# EAGLE design AUX power board (V3.2) (EAGLE 7.5.0)
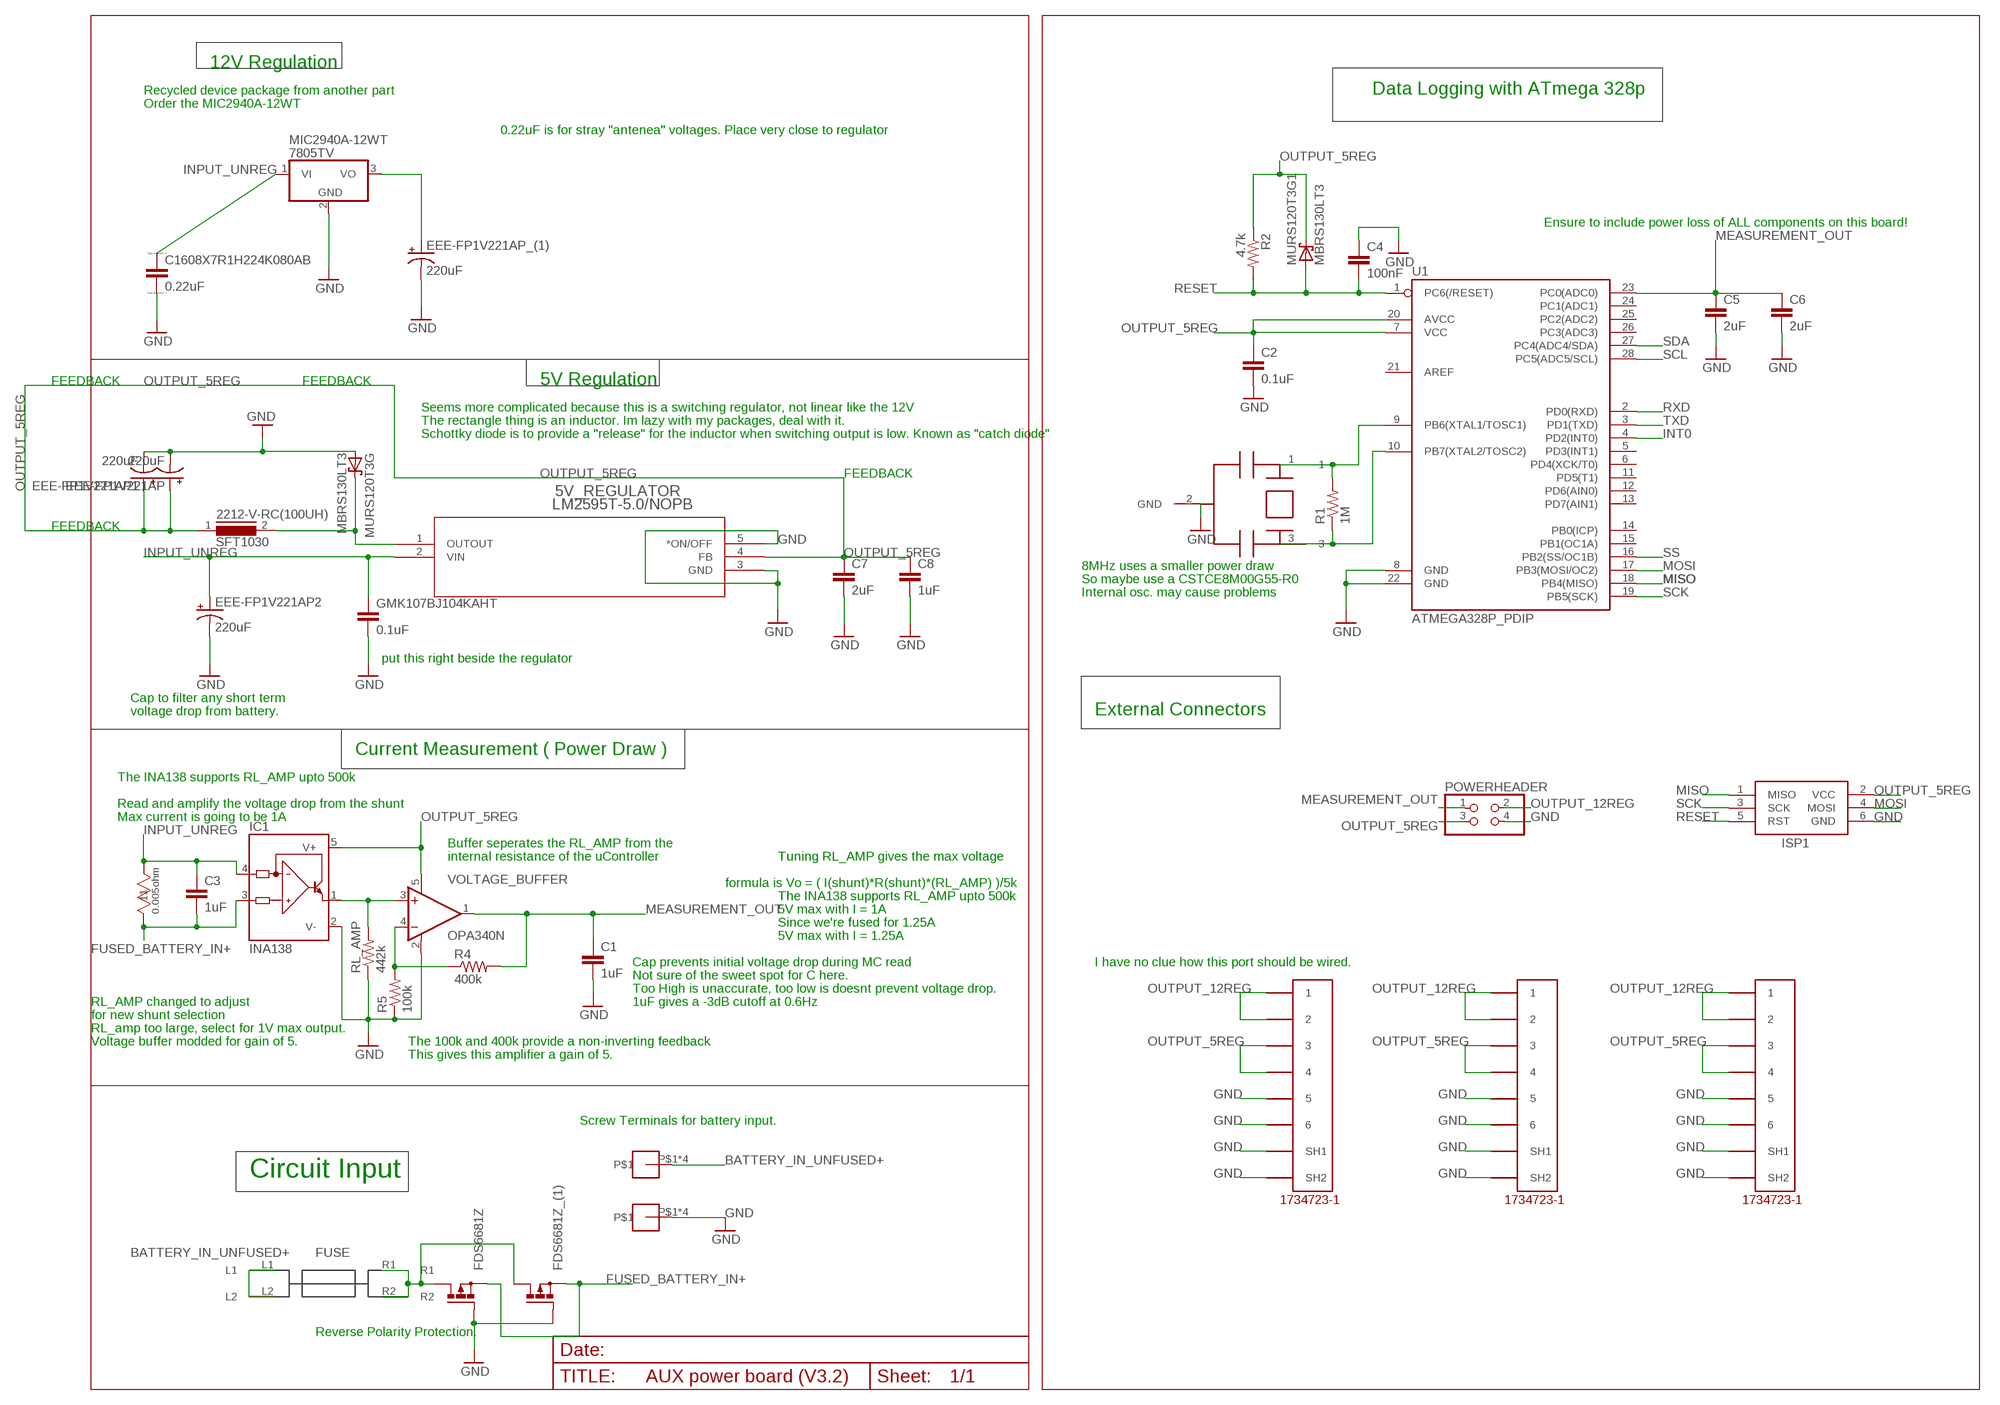
[diagram p0: schematic, sheet 1]

## Parts
5V_REGULATOR  LM2595T-5.0/NOPB  [T05D]
15FR005E  15FR005E  [RES_15]
2212-V-RC(100UH)  SFT1030  [SFT1030]
C1  1uF  C-EUC0603  [C0603]
C2  0.1uF  C-EUC0603  [C0603]
C3  1uF  C-EUC0603  [C0603]
C4  100nF  C-EUC0603  [C0603]
C5  2uF  C-EUC0603  [C0603]
C6  2uF  C-EUC0603  [C0603]
C7  2uF  C-EUC0603  [C0603]
C8  1uF  C-EUC0603  [C0603]
C1608X7R1H224K080AB  0.22uF  CC0603  [C0603]
CSTCE8M00G55-R0  CSTCE16M0V53-R0  [RESONATOR]
EEE-FP1V221AP  220uF  CPOL-US175TMP-0808  [175TMP-0808]
EEE-FP1V221AP1  220uF  CPOL-US175TMP-0808  [175TMP-0808]
EEE-FP1V221AP2  220uF  CPOL-US175TMP-0808  [175TMP-0808]
EEE-FP1V221AP_(1)  220uF  CPOL-US175TMP-0808  [175TMP-0808]
FDS6681Z  P-MOSFET-SO8  [SO-08]
FDS6681Z_(1)  P-MOSFET-SO8  [SO-08]
GMK107BJ104KAHT  0.1uF  C-EUC0603  [C0603]
IC1  INA138  [SOT23-5]
ISP1  AVRISP-6  [AVRISP]
MIC2940A-12WT  7805TV  [TO220V]
MINIBLADE  3568  [3568]
MURS120T3G  MBRS130LT3  [SMB]
MURS120T3G1  MBRS130LT3  [SMB]
POWERHEADER  PINHD-2X2  [2X02]
R1  1M  R-US_R0603  [R0603]
R2  4.7k  R-US_R0603  [R0603]
R4  400k  R-US_R0603  [R0603]
R5  100k  R-US_R0603  [R0603]
RL_AMP  442k  R-US_R0603  [R0603]
U1  ATMEGA328P_PDIP  [DIL28-3]
U$3  5555140-6  [1734723-1_RJ11]
U$4  5555140-6  [1734723-1_RJ11]
U$5  5555140-6  [1734723-1_RJ11]
U$6  SCREW-8191  [SCREW-8191]
U$7  SCREW-8191  [SCREW-8191]
VOLTAGE_BUFFER  OPA340N  [SOT23-5]

## Nets
BATTERY_IN_UNFUSED+: MINIBLADE.L1 MINIBLADE.L2 U$6.P$1 U$6.P$2 U$6.P$3 U$6.P$4
FUSED_BATTERY_IN+: 15FR005E.1 C3.2 FDS6681Z.1(S) FDS6681Z.2(S) FDS6681Z.3(S) FDS6681Z_(1).1(S) FDS6681Z_(1).2(S) FDS6681Z_(1).3(S) IC1.3(IN+)
GND: 5V_REGULATOR.3(GND) 5V_REGULATOR.5(*ON/OFF) C1.2 C2.2 C4.1 C5.2 C6.2 C7.2 C8.2 C1608X7R1H224K080AB.2 CSTCE8M00G55-R0.2(GND) EEE-FP1V221AP1.- EEE-FP1V221AP2.- EEE-FP1V221AP.- EEE-FP1V221AP_(1).- FDS6681Z.4(G) FDS6681Z_(1).4(G) GMK107BJ104KAHT.2 IC1.2(V-) ISP1.6(GND) MIC2940A-12WT.2(GND) MURS120T3G.A POWERHEADER.4 R5.1 RL_AMP.1 U1.8(GND) U1.22(GND) U$3.5 U$3.6 U$3.SH1 U$3.SH2 U$4.5 U$4.6 U$4.SH1 U$4.SH2 U$5.5 U$5.6 U$5.SH1 U$5.SH2 U$7.P$1 U$7.P$2 U$7.P$3 U$7.P$4 VOLTAGE_BUFFER.2(V-)
INPUT_UNREG: 5V_REGULATOR.2(VIN) 15FR005E.2 C3.1 C1608X7R1H224K080AB.1 EEE-FP1V221AP2.+ GMK107BJ104KAHT.1 IC1.4(IN-) MIC2940A-12WT.1(VI)
INT0: U1.4(PD2(INT0))
MEASUREMENT_OUT: C1.1 C5.1 C6.1 POWERHEADER.1 R4.2 U1.23(PC0(ADC0)) VOLTAGE_BUFFER.1(OUT)
MISO: ISP1.1(MISO) U1.18(PB4(MISO))
MMM: FDS6681Z.5(D) FDS6681Z.6(D) FDS6681Z.7(D) FDS6681Z.8(D) FDS6681Z_(1).5(D) FDS6681Z_(1).6(D) FDS6681Z_(1).7(D) FDS6681Z_(1).8(D) MINIBLADE.R1 MINIBLADE.R2
MOSI: ISP1.4(MOSI) U1.17(PB3(MOSI/OC2))
N$1: 5V_REGULATOR.1(OUTOUT) 2212-V-RC(100UH).2 MURS120T3G.C
N$2: R4.1 R5.2 VOLTAGE_BUFFER.4(-IN)
N$3: IC1.1(OUT) RL_AMP.2 VOLTAGE_BUFFER.3(+IN)
N$18: CSTCE8M00G55-R0.1 R1.2 U1.9(PB6(XTAL1/TOSC1))
N$19: CSTCE8M00G55-R0.3 R1.1 U1.10(PB7(XTAL2/TOSC2))
OUTPUT_5REG: 5V_REGULATOR.4(FB) 2212-V-RC(100UH).1 C2.1 C7.1 C8.1 EEE-FP1V221AP1.+ EEE-FP1V221AP.+ IC1.5(V+) ISP1.2(VCC) MURS120T3G1.C POWERHEADER.3 R2.1 U1.7(VCC) U1.20(AVCC) U$3.3 U$3.4 U$4.3 U$4.4 U$5.3 U$5.4 VOLTAGE_BUFFER.5(V+)
OUTPUT_12REG: EEE-FP1V221AP_(1).+ MIC2940A-12WT.3(VO) POWERHEADER.2 U$3.1 U$3.2 U$4.1 U$4.2 U$5.1 U$5.2
RESET: C4.2 ISP1.5(RST) MURS120T3G1.A R2.2 U1.1(PC6(/RESET))
RXD: U1.2(PD0(RXD))
SCK: ISP1.3(SCK) U1.19(PB5(SCK))
SCL: U1.28(PC5(ADC5/SCL))
SDA: U1.27(PC4(ADC4/SDA))
SS: U1.16(PB2(SS/OC1B))
TXD: U1.3(PD1(TXD))
Unconnected: U1.5(PD3(INT1)) U1.6(PD4(XCK/T0)) U1.11(PD5(T1)) U1.12(PD6(AIN0)) U1.13(PD7(AIN1)) U1.14(PB0(ICP)) U1.15(PB1(OC1A)) U1.21(AREF) U1.24(PC1(ADC1)) U1.25(PC2(ADC2)) U1.26(PC3(ADC3))

## Notes on the sheet
- 12V Regulation
- Recycled device package from another part | Data Logging with ATmega 328p
- Order the MIC2940A-12WT
- 0.22uF is for stray "antenea" voltages. Place very close to regulator
- Ensure to include power loss of ALL components on this board!
- FEEDBACK | FEEDBACK | 5V Regulation
- Seems more complicated because this is a switching regulator, not linear like the 12V
- The rectangle thing is an inductor. Im lazy with my packages, deal with it.
- Schottky diode is to provide a "release" for the inductor when switching output is low. Known as "catch diode"
- FEEDBACK
- FEEDBACK
- 8MHz uses a smaller power draw
- So maybe use a CSTCE8M00G55-R0
- Internal osc. may cause problems
- put this right beside the regulator
- Cap to filter any short term
- voltage drop from battery. | External Connectors
- Current Measurement ( Power Draw )
- The INA138 supports RL_AMP upto 500k
- Read and amplify the voltage drop from the shunt
- Max current is going to be 1A
- Buffer seperates the RL_AMP from the
- internal resistance of the uController | Tuning RL_AMP gives the max voltage
- formula is Vo = ( I(shunt)*R(shunt)*(RL_AMP) )/5k
- The INA138 supports RL_AMP upto 500k
- 5V max with I = 1A
- Since we're fused for 1.25A
- 5V max with I = 1.25A
- Cap prevents initial voltage drop during MC read | I have no clue how this port should be wired.
- Not sure of the sweet spot for C here.
- Too High is unaccurate, too low is doesnt prevent voltage drop.
- RL_AMP changed to adjust | 1uF gives a -3dB cutoff at 0.6Hz
- for new shunt selection
- RL_amp too large, select for 1V max output.
- Voltage buffer modded for gain of 5. | The 100k and 400k provide a non-inverting feedback
- This gives this amplifier a gain of 5.
- Screw Terminals for battery input.
- Circuit Input
- Reverse Polarity Protection.

## Library data of the parts
5V_REGULATOR = LM2595T-5:LM2595T-5.0/NOPB; COPYRIGHT: Copyright C 2015 Accelerated Designs. All rights reserved; MANUFACTURER_PART_NUMBER: LM2595T50; VENDOR: National Semiconductor
15FR005E = 15FR005E:15FR005E; COPYRIGHT: Copyright C 2015 Accelerated Designs. All rights reserved; MANUFACTURER_PART_NUMBER: 15FR005E; VENDOR: Ohmite
2212-V-RC(100UH) = inductors:SFT1030: INDUCTOR
C1 C2 = resistor:C-EU: CAPACITOR, European symbol
C3-C8 GMK107BJ104KAHT = rcl:C-EU: CAPACITOR, European symbol
C1608X7R1H224K080AB = eagle-ltspice:C: CAPACITOR, European symbol; SPICEMODEL: NONE; SPICEPREFIX: C
CSTCE8M00G55-R0 = arduino_Uno_Rev3-02-TH:CSTCE16M0V53-R0
EEE-FP1V221AP EEE-FP1V221AP1 EEE-FP1V221AP2 EEE-FP1V221AP_(1) = rcl:CPOL-US: POLARIZED CAPACITOR, American symbol
FDS6681Z FDS6681Z_(1) = transistor-power:P-MOSFET-SO8: P-Channel MOSFET Example: FDS4435A; P-Channel Logic Level PowerTrench® MOSFET FDS4465; P-Channel 1.8V Specified PowerTrench® MOSFET Source: www.fairchildsemi.com
IC1 = burr-brown:INA138: High-Side Measurement Current Shunt Monitor; MF: TEXAS INSTRUMENTS; MPN: INA138NA/250; OC_FARNELL: 1564888; OC_NEWARK: 80K5906
ISP1 = adafruit:AVRISP: AVR ISP HEADER Standard 6 pin header for AVR programming
MIC2940A-12WT = linear:78*: Positive VOLTAGE REGULATOR Source: http://cache.national.com/ds/LM/LM78L05.pdf http://www.fairchildsemi.com/ds/LM/LM7805.pdf
MINIBLADE = fuse:3568
MURS120T3G MURS120T3G1 = diode:MBRS130LT3: Schottky Power Rectifier Source: http://www.onsemi.com/pub/Collateral/MBRS130LT3-D.PDF
POWERHEADER = pinhead:PINHD-2X2: PIN HEADER
R1 = rcl:R-US_: RESISTOR, American symbol
R2 R4 R5 RL_AMP = resistor:R-US_: RESISTOR, American symbol
U1 = SparkFun-DigitalIC:ATMEGA328P_PDIP: uC used in the Arduino 32kb flash, 1k EEPROM, 2k SRAM This is the through-hole version of this chip.
U$3-U$5 = 5555140-6 RJ11:5555140-6
U$6 U$7 = Shell2013:SCREW-8191
VOLTAGE_BUFFER = burr-brown:OPA340: Rail-to-Rail Operational Amplifiers Single-Supply, MicroAmplifier(TM) Series; MPN: OPA340NA/3KG4; OC_FARNELL: 1234805; OC_NEWARK: 13M5177

## Board
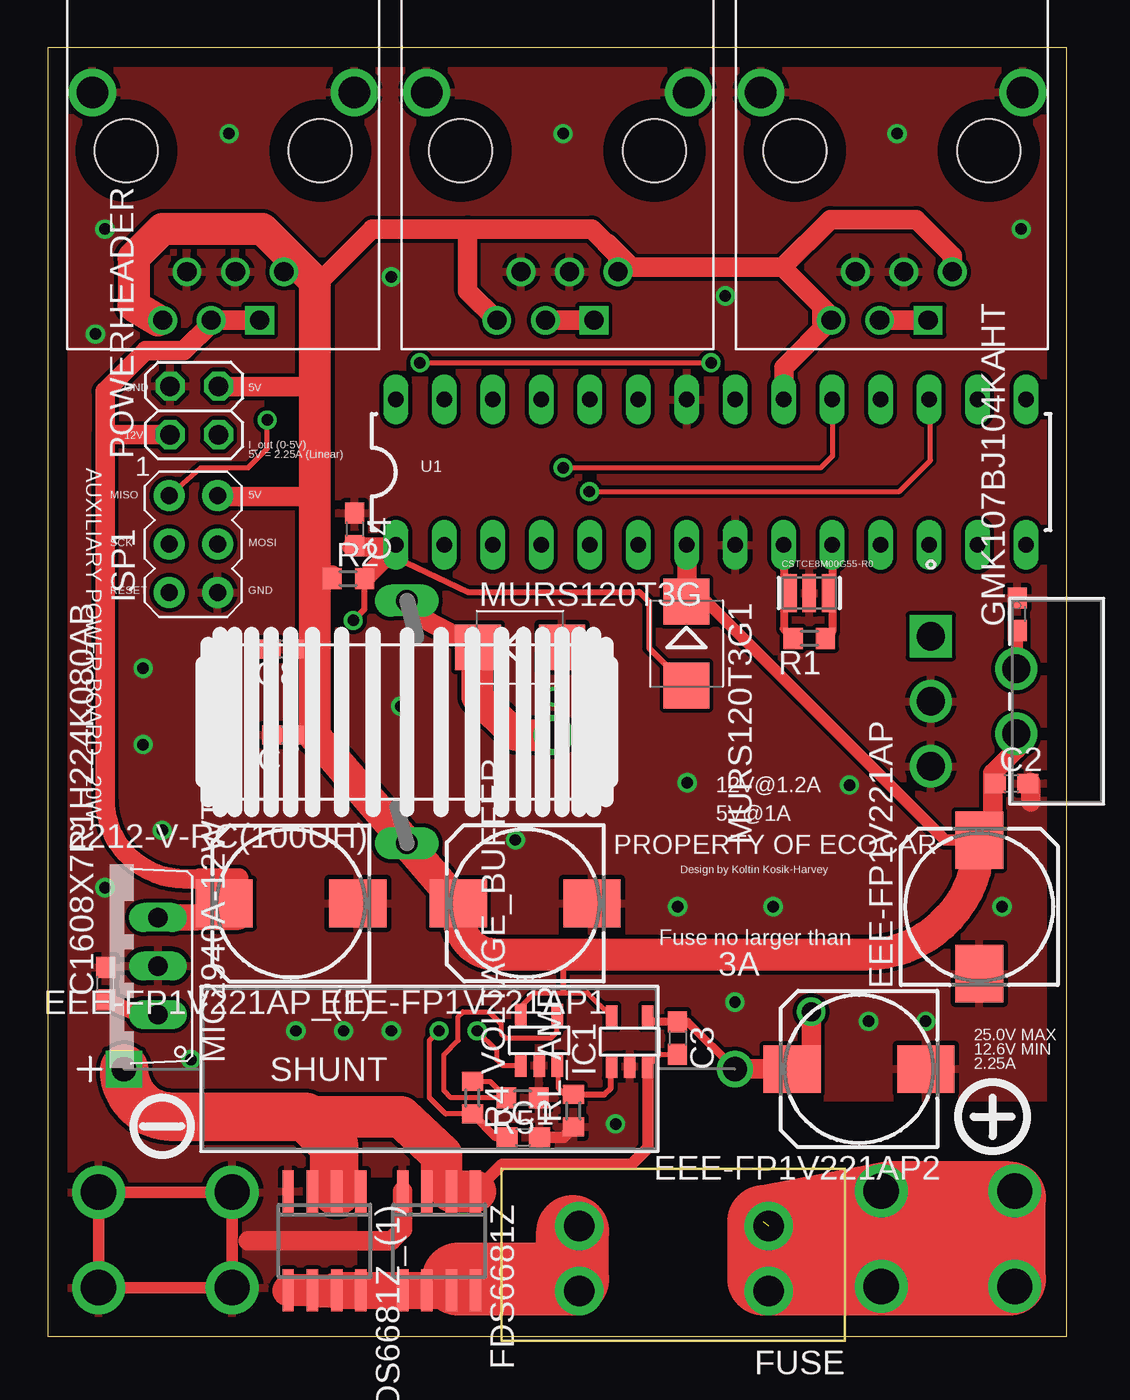
[diagram p1: board, top side]
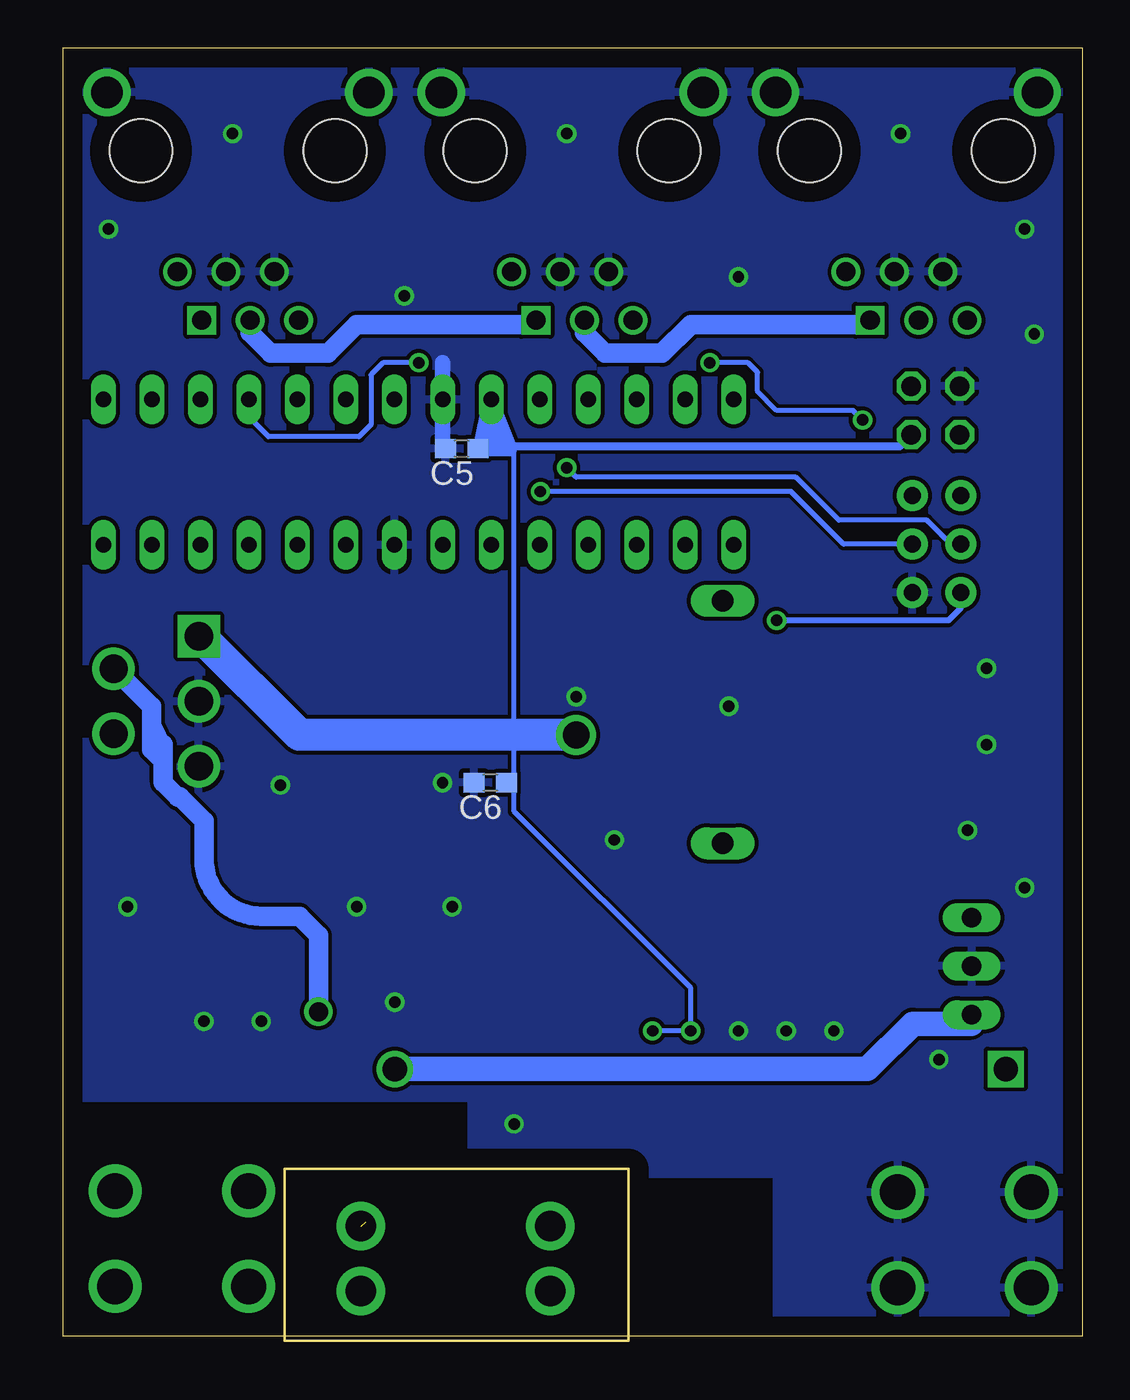
[diagram p2: board, bottom side, seen from below]

Size 53.38 x 67.5 mm. Coordinates in mm from the lower left corner, seen from the top.
Outline: 0,0 53.38,0 53.38,67.5 0,67.5 0,0
Copper layers (1*16): Top 0.035mm / dielectric 1.5mm / Bottom 0.035mm
Design rules "default": minimum track width 10mil, minimum drill 24mil, track to track 8mil, track to pad 8mil, pad to pad 8mil, via to via 8mil, smd to smd 8mil, copper to edge 40mil, drill to drill 8mil, minimum pad ring 10mil, minimum via ring 8mil, stop-mask expansion 4mil, vias tented up to drill 0mil, thermal gap 10mil

### Footprints (pad centres in the part's own frame; a part is rotated, then mirrored left to right if it is on the bottom)
T05D = drill 1.473 pad 1.981 square: 1 -6.807,-13.183 | drill 1.473 pad 1.981: 2 -5.105,-8.712; 3 -3.404,-13.183; 4 -1.702,-8.712; 5 0,-13.183
RES_15 = drill 1.27 pad 1.778 square: 1 -32.004,0 | drill 1.27 pad 1.778: 2 0,0
SFT1030 = drill 1.118 long: 1 -6.35,0; 2 6.35,0
C0603 = smd 1.1 x 1: 1 -0.85,0; 2 0.85,0
RESONATOR = smd 0.7 x 2: 1 -1,0; 2 0,0; 3 1,0
175TMP-0808 = smd 3 x 2.5: + 3.5,0; - -3.5,0
SO-08 = smd 0.6 x 2.2: 1 -1.905,-2.6; 2 -0.635,-2.6; 3 0.635,-2.6; 4 1.905,-2.6; 5 1.905,2.6; 6 0.635,2.6; 7 -0.635,2.6; 8 -1.905,2.6
SOT23-5 = smd 0.6 x 1.2: 1 -0.95,-1.306; 2 0,-1.306; 3 0.95,-1.306; 4 0.95,1.306; 5 -0.95,1.306
AVRISP = drill 0.9 pad 1.626: 1 -1.27,2.54; 2 1.27,2.54; 3 -1.27,0; 4 1.27,0; 5 -1.27,-2.54; 6 1.27,-2.54
TO220V = drill 1.016 long: 1 -2.54,-2.54; 2 0,-2.54; 3 2.54,-2.54
3568 = drill 1.6 pad 2.54: L1 0,3.4; L2 0,0; R1 9.92,3.4; R2 9.92,0
SMB = smd 2.4 x 2.4: A 2.2,0; C -2.2,0
2X02 = drill 1.016 octagon: 1 -1.27,-1.27; 2 -1.27,1.27; 3 1.27,-1.27; 4 1.27,1.27
R0603 = smd 1 x 1.1: 1 -0.85,0; 2 0.85,0
DIL28-3 = drill 0.813 long: 1 -16.51,-3.81; 2 -13.97,-3.81; 3 -11.43,-3.81; 4 -8.89,-3.81; 5 -6.35,-3.81; 6 -3.81,-3.81; 7 -1.27,-3.81; 8 1.27,-3.81; 9 3.81,-3.81; 10 6.35,-3.81; 11 8.89,-3.81; 12 11.43,-3.81; 13 13.97,-3.81; 14 16.51,-3.81; 15 16.51,3.81; 16 13.97,3.81; 17 11.43,3.81; 18 8.89,3.81; 19 6.35,3.81; 20 3.81,3.81; 21 1.27,3.81; 22 -1.27,3.81; 23 -3.81,3.81; 24 -6.35,3.81; 25 -8.89,3.81; 26 -11.43,3.81; 27 -13.97,3.81; 28 -16.51,3.81
1734723-1_RJ11 = drill 1 square: 1 -2.54,2.54 | drill 1: 2 0,2.54; 3 2.54,2.54; 4 -3.81,0; 5 -1.27,0; 6 1.27,0 | drill 1.65: SH1 -7.5,-9.4; SH2 6.22,-9.4 | hole 3.3: -5.72,-6.35; 4.44,-6.35
SCREW-8191 = drill 1.85: P$1 0,0; P$2 0,5; P$3 7,5; P$4 7,0

### Placement (x,y rotation side)
5V_REGULATOR  59.45,29.86 270 top
15FR005E  36,14 0 top
2212-V-RC(100UH)  18.82,32.18 90 top
C1  24.91,10.44 0 top
C2  50.49,28.96 0 top
C3  33,15.62 270 top
C4  16.09,42.28 270 top
C5  32.5,46.5 180 bottom
C6  31,29 180 bottom
C7  12.62,31.5 180 top
C8  12.5,36 180 top
C1608X7R1H224K080AB  3.04,18.48 90 top
CSTCE8M00G55-R0  39.9,38.94 0 top
EEE-FP1V221AP  48.8,22.5 90 top
EEE-FP1V221AP1  25.02,22.68 180 top
EEE-FP1V221AP2  42.5,14 180 top
EEE-FP1V221AP_(1)  12.74,22.67 180 top
FDS6681Z  20.5,5 180 top
FDS6681Z_(1)  14.5,5 180 top
GMK107BJ104KAHT  50.79,37.83 90 top
IC1  30.49,15.44 0 top
ISP1  7.62,41.5 0 top
MIC2940A-12WT  3.24,19.39 90 top
MINIBLADE  37.77,5.77 180 top
MURS120T3G  24.74,36.09 0 top
MURS120T3G1  33.47,36.29 270 top
POWERHEADER  7.68,48.5 90 top
R1  39.9,36.56 180 top
R2  15.74,39.69 0 top
R4  22.25,12.5 270 top
R5  24.88,12.5 180 top
RL_AMP  27.54,11.81 90 top
U1  34.75,45.27 0 top
U$3  8.56,55.76 180 top
U$4  26.07,55.76 180 top
U$5  43.58,55.76 180 top
U$6  50.66,7.61 180 top
U$7  2.66,2.55 0 top
VOLTAGE_BUFFER  25.74,15.5 0 top

### Tracks (layer width: path | path; a pad name or v marks a point on that pad's centre or on a via)
BATTERY_IN_UNFUSED+  (1 unrouted)
  Top 0.813: MINIBLADE.L2 MINIBLADE.L1 43.66,2.37 U$6.P$3
  Top 3.81: 37.5,6 37.5,3 43.5,3 | 43.5,3 50.38,3 50.38,7.25 44,7.25 | 44,7.25 44,4.88 47.5,4.88 | 37.5,6 43.5,3 | 37.5,6 44,7.25
FUSED_BATTERY_IN+
  Top 0.254: IC1.3 32.08,14.78 C3.2 | FDS6681Z.3 20.62,8.23
  Top 0.61: IC1.3 31.44,9.86 30.58,9 23.8,9 FDS6681Z.1 | 15,7.74 FDS6681Z_(1).3 | FDS6681Z_(1).2 FDS6681Z_(1).1
  Top 2.184: FDS6681Z.1 FDS6681Z.2 20.62,8.23 20.62,9.5 18.5,11.5 12.5,11.5
  Top 2.54: 15FR005E.1 arc90 6.5,11.5 12.5,11.5 13.5,11.5 15,10 15,7.74 FDS6681Z_(1).2
GND  (via drill 0.6)
  Top 0.61: C1.2 27.01,10.44 RL_AMP.1
  Top 1.016: 51.5,29 51.5,28 | FDS6681Z.4 18.59,5.59 18,5 10.5,5
  Bottom 0.813: 33.5,46.5 33.5,51
  other vias: 43,16.5 46,16.5 50,22.5 36,17.5 13,16 18,16 7.5,14.5 15.5,16 3,23.5 6,26.5 38,22.5 33,22.5 29.75,11.12 42,28.88 51,58 3,58 27,63 44.5,63 9.5,63 33.5,29 24.5,26 26.5,33.5 18.5,33 5,31 5,35 18,55.5 35.5,54.5 2.5,52.5
  pour Top: -0.5,68 55.5,68 55.5,12.5 32,12.5 32,8.5 16,8.5 16,-2 -0.5,-2
  pour Bottom: -1,68.5 56,68.5 56,12.5 32,12.5 32,8.5 16,8.5 16,-2.5 -1,-2.5
INPUT_UNREG  (via drill 1)
  Top 0.254: C3.1 33.52,16.48 | 31.71,16.48 IC1.4 31.44,16.56 31.5,16.5 | 4.83,16.85 MIC2940A-12WT.1
  Top 0.406: 33.52,16.48 15FR005E.2 | C3.1 31.71,16.48
  Top 0.61: GMK107BJ104KAHT.1 50.79,35.02 5V_REGULATOR.2 | EEE-FP1V221AP2.+ 39.5,14 40,14.5
  Top 0.813: C1608X7R1H224K080AB.1 4.83,16.85
  Top 1.016: 15FR005E.2 EEE-FP1V221AP2.+ | 40,14.5 v40,17
  Bottom 1.016: 5.8,16.38 MIC2940A-12WT.1 | v40,17 40,21 41,22 43,22 arc90 46,25 46,27 47.25,28.25 47.38,28.25 48.12,29 48.12,30.12 | 48.12,30.12 48.75,30.75 48.75,32 | 48.75,32 48.75,33 50.72,34.97 5V_REGULATOR.2 | 48.12,30.75 48.75,32 | 48.12,31 48.12,30.12
  Bottom 1.27: 15FR005E.2 11.25,14 8.88,16.38 5.8,16.38
MEASUREMENT_OUT  (via drill 0.6)
  Top 0.254: 23.84,10.65 C1.1 23.46,10.44 | R4.2 20.85,11.65 20,12.5 20,15.5 v20.5,16 | v22.5,16 23.5,15 23.5,14.5 23.81,14.19 VOLTAGE_BUFFER.1
  Top 0.406: R4.2 23.46,10.44
  Bottom 0.254: v22.5,16 v20.5,16 20.5,18.25 29.75,27.5 29.75,29 | 29.75,29 29.75,46.5 | 29.75,46.5 29.75,46.62 30.88,47.75 30.88,49.02 U1.23 | C5.1 31.5,46.5 31,46.5 | 30,46.5 29.75,46.5 | C6.1 29.75,29
  Bottom 0.406: 29.75,46.62 9.55,46.62 POWERHEADER.1
  Bottom 0.813: 31.5,46.5 31,49 | 31,49 31,46.5 30,46.5 31,49
MISO  (via drill 0.6)
  Top 0.254: ISP1.1 8,45.5 10.5,45.5 11.5,46.5 v11.5,48 | v19.5,51 v34.75,51
  Bottom 0.254: v11.5,48 12,48.5 16,48.5 17,49.5 17,50.5 17.5,51 v19.5,51 | v34.75,51 36.62,51 37.25,50.38 37.25,47.75 37.88,47.12 42.62,47.12 43.64,48.14 U1.18
MMM
  Top 0.813: MINIBLADE.R2 MINIBLADE.R1
  Top 1.676: 13.89,2.37 FDS6681Z_(1).6 FDS6681Z_(1).5 | 13.89,2.37 MINIBLADE.R1 | 13.89,2.37 13.93,2.4 FDS6681Z_(1).7 | FDS6681Z.7 FDS6681Z.8
  Top 1.93: FDS6681Z_(1).7 FDS6681Z_(1).8 FDS6681Z.5 FDS6681Z.6 FDS6681Z.7
MOSI  (via drill 0.6)
  Top 0.254: v28.38,44.25 44.62,44.25 46.25,45.88 46.25,49.01 U1.17
  Bottom 0.254: ISP1.4 12.5,41.5 15.25,44.25 v28.38,44.25
N$1  (via drill 1.4 pad 1.78)
  Top 1.016: 2212-V-RC(100UH).2 19.36,37.77 MURS120T3G.C
  Top 1.676: MURS120T3G.C 22.5,36.09 22.5,33.5 24.5,31.5 v26.5,31.5
  Bottom 1.676: v26.5,31.5 41,31.5 46.17,36.67 5V_REGULATOR.1
N$2
  Top 0.254: 23.88,12.35 R5.2 | R5.2 21.12,12.5 20.75,12.88 20.75,14.75 21.5,15.5 21.5,16.75 21.75,17 23.12,17 23.75,16.38 23.75,15.88 24,15.62 26.38,15.62 26.69,15.94 VOLTAGE_BUFFER.4 | R4.1 23.18,13.35 R5.2
N$3
  Top 0.254: 29.5,14.09 IC1.1 | RL_AMP.2 27.09,12.66 26.75,13 26.75,14.13 VOLTAGE_BUFFER.3
  Top 0.305: RL_AMP.2 29.16,12.66 29.5,13 29.5,14.09
N$5
  Top 3.81: 21.5,3 27.5,3 27.5,5.5
N$6
  Top 1.676: 11.75,57.5 14,55.25
N$10
  Top 0.406: 40.25,54.5 40.25,52.62
N$18
  Top 0.406: U1.9 38.56,39 | 38.56,39 38.56,37.05 R1.2 | CSTCE8M00G55-R0.1 38.62,38.94 38.56,39
N$19
  Top 0.406: U1.10 41.1,39 | 41.1,39 41.1,36.91 R1.1 | CSTCE8M00G55-R0.3 41.03,38.94 41.1,39
OUTPUT_5REG
  Top 0.254: VOLTAGE_BUFFER.5 24.79,17.29 25.5,18 27,18 28.29,18 IC1.5
  Top 0.305: 27,20 27,18
  Top 0.406: 33.5,38.5 34.5,38.5 | 29.5,57.5 31,56
  Top 0.61: 34.5,38.5 47,26 EEE-FP1V221AP.+ | C7.1 14,31.41 | C8.1 14,36
  Top 1.016: EEE-FP1V221AP1.+ 21.52,21.98 | EEE-FP1V221AP.+ 49.5,26.69 49.5,29 | 49.5,29 49.5,29.5 50.74,30.74 5V_REGULATOR.4 | C2.1 49.6,29 49.5,29 | 5.78,53.22 U$3.3 | 22,58 17,58 14,55 13.24,55.76 U$3.4 12.37,56.88 | 22,58 28.5,58 29.88,56.62 U$4.4 30.12,56 31,56 38.5,56 | U$4.3 22,54.75 22,58 | 38.5,56 41,58.5 45.5,58.5 47.39,56.61 U$5.4 | 38.5,56 41.04,53.46 U$5.3 38.56,50.74 U1.20 | MURS120T3G1.C 33.48,38.51 U1.7 33.5,41.44 33.5,38.5 | POWERHEADER.3 8.95,49.75 14,49.75 | ISP1.2 8.89,44 14,44 | R2.1 14.89,39.88 14,39.88
  Top 1.676: EEE-FP1V221AP1.+ 2212-V-RC(100UH).1 14,31.41 14,36 14,39.88 14,44 14,49.75 14,55 | 21.52,21.98 arc90 23.5,20 27,20 42.81,20 arc90 EEE-FP1V221AP.+ | 5.78,53.22 4.5,54 4.5,56.5 6,58 11.26,58 12.37,56.88
OUTPUT_12REG
  Top 0.254: 7.5,24 10,24 EEE-FP1V221AP_(1).+
  Top 1.016: U$4.2 U$4.1 | U$3.1 U$3.2 8.56,53.06 7.12,51.62 5.12,51.62 3,49.5 3,47.25 | U$5.2 U$5.1 | 3,47.25 3,28.12 arc90 7.17,23.95 7.96,23.95 arc-90 8,24 10,24 | 3,47.25 3.02,47.23 POWERHEADER.2
  Top 1.422: MIC2940A-12WT.3 10,22 EEE-FP1V221AP_(1).+
  Bottom 1.016: U$3.1 11.32,53 20.5,53 22,51.5 25,51.5 26.07,52.57 U$4.2 | U$4.1 28.83,53 38,53 39.5,51.5 42.5,51.5 43.58,52.58 U$5.2
RESET  (via drill 0.6)
  Top 0.305: 18.24,41.34 18.24,40.76 22,39 31,39 31.5,38.5 31.5,36.05 MURS120T3G1.A | v16,37.5 16.59,38.09 R2.2
  Top 1.016: U1.1 18.24,41.34 | 18.24,41.34 R2.2 | 18.24,41.34 15.94,41.34 C4.2
  Bottom 0.305: ISP1.5 6.36,38.15 7,37.5 v16,37.5
SCK  (via drill 0.6)
  Top 0.254: v27,45.5 40.5,45.5 41.12,46.12 41.12,49.05 U1.19
  Bottom 0.254: ISP1.3 6.88,41.5 8.12,42.75 12.75,42.75 15,45 26.5,45 v27,45.5

### Text on the board
tPlace: GND | 5V | 12V | AUXILIARY POWER BOARD - 20W | 5V = 2.25A (Linear) | I_out (0-5V) | MISO | 5V | SCK | MOSI | RESET | GND | 12V@1.2A | 5V@1A | PROPERTY OF ECOCAR | Design by Koltin Kosik-Harvey | Fuse no larger than | 3A | 25.0V MAX | 12.6V MIN | 2.25A